# Altium schematic sheet Sheet1.SchDoc
size A4; SheetNumber: 1; SheetTotal: 1
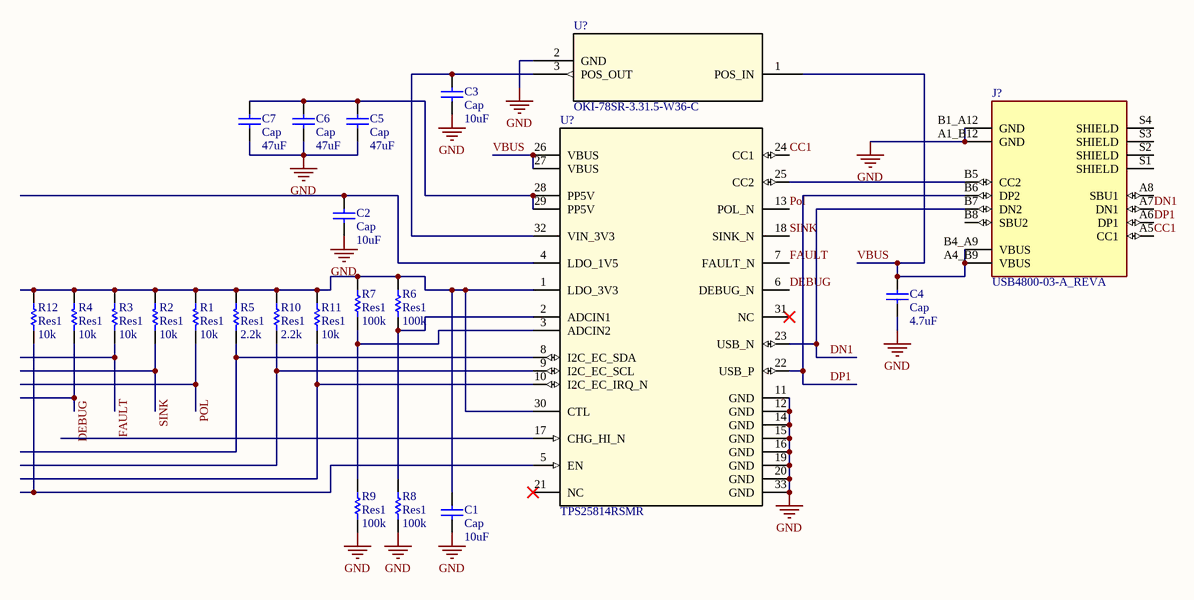
[diagram p0: Sheet1.SchDoc]

## Parts
(Parts that share a designator on the sheet are numbered #1, #2 ... from top to bottom, then left to right.)
C1  Cap  value 10uF  [RAD-0.3]
C2  Cap  value 10uF  [RAD-0.3]
C3  Cap  value 10uF  [RAD-0.3]
C4  Cap  value 4.7uF  [RAD-0.3]
C5  Cap  value 47uF  [RAD-0.3]
C6  Cap  value 47uF  [RAD-0.3]
C7  Cap  value 47uF  [RAD-0.3]
J?  USB4800-03-A_REVA  [GCT_USB4800-03-A_REVA]
R1  Res1  value 10k  [AXIAL-0.3]
R2  Res1  value 10k  [AXIAL-0.3]
R3  Res1  value 10k  [AXIAL-0.3]
R4  Res1  value 10k  [AXIAL-0.3]
R5  Res1  value 2.2k  [AXIAL-0.3]
R6  Res1  value 100k  [AXIAL-0.3]
R7  Res1  value 100k  [AXIAL-0.3]
R8  Res1  value 100k  [AXIAL-0.3]
R9  Res1  value 100k  [AXIAL-0.3]
R10  Res1  value 2.2k  [AXIAL-0.3]
R11  Res1  value 10k  [AXIAL-0.3]
R12  Res1  value 10k  [AXIAL-0.3]
U?#1  OKI-78SR-3.31.5-W36-C  [OKI-78SR_MUR]
U?#2  TPS25814RSMR  [RSM0032B-IPC_A]

## Nets
GND: C1.1 C2.1 C3.2 C4.2 C5.1 C6.1 C7.1 J?.A1_B12(GND) J?.B1_A12(GND) R8.1 R9.1 U?#1.2(GND) U?#2.11(GND) U?#2.12(GND) U?#2.14(GND) U?#2.15(GND) U?#2.16(GND) U?#2.19(GND) U?#2.20(GND) U?#2.33(GND)
CC1: J?.A5(CC1) U?#2.24(CC1)
DEBUG: R4.1 U?#2.6(DEBUG_N)
DN1: J?.A7(DN1) J?.B7(DN2) U?#2.23(USB_N)
DP1: J?.A6(DP1) J?.B6(DP2) U?#2.22(USB_P)
FAULT: R3.1 U?#2.7(FAULT_N)
Pol: R1.1 U?#2.13(POL_N)
SINK: R2.1 U?#2.18(SINK_N)
VBUS: C4.1 J?.A4_B9(VBUS) J?.B4_A9(VBUS) U?#1.1(POS_IN) U?#2.26(VBUS) U?#2.27(VBUS)
NetC1_2: C1.2 R1.2 R2.2 R3.2 R4.2 R5.2 R6.2 R7.2 R10.2 R11.2 R12.2 U?#2.1(LDO_3V3) U?#2.30(CTL)
NetC2_2: C2.2 U?#2.4(LDO_1V5)
NetC3_1: C3.1 U?#1.3(POS_OUT) U?#2.32(VIN_3V3)
NetC5_2: C5.2 C6.2 C7.2 U?#2.28(PP5V) U?#2.29(PP5V)
NetJ?_B5: J?.B5(CC2) U?#2.25(CC2)
NetR5_1: R5.1 U?#2.8(I2C_EC_SDA)
NetR6_1: R6.1 R8.2 U?#2.2(ADCIN1)
NetR7_1: R7.1 R9.2 U?#2.3(ADCIN2)
NetR10_1: R10.1 U?#2.9(I2C_EC_SCL)
NetR11_1: R11.1 U?#2.10(I2C_EC_IRQ_N)
NetR12_1: R12.1 U?#2.5(EN)

Not connected (* = marked no-connect by the designer): J? A8(SBU1) B8(SBU2) S1(SHIELD) S2(SHIELD) S3(SHIELD) S4(SHIELD); U?#2 17(CHG_HI_N) 21(NC)* 31(NC)*

## Library data of the parts
C1-C7 = Cap: Capacitor; Published: 8-Jun-2000; LatestRevisionDate: 17-Jul-2002; LatestRevisionNote: Re-released for DXP Platform.; PackageReference: RAD-0.3; Publisher: Altium Limited; PackageDescription: Radial Cap, Thru-Hole; 2 Leads; 0.3 in Pin Spacing
J? = USB4800-03-A_REVA: USB-C (USB TYPE-C) USB 2.0 Receptacle Connector 24 (16+8 Dummy) Position Surface Mount, Right Angle; Through Hole; MF: Global Connector Technology; SnapEDA_Link: https://www.snapeda.com/parts/USB4800-03-A/Global+Connector+Technology/view-part/?ref=snap; Package: None; MP: USB4800-03-A; Check_prices: https://www.snapeda.com/parts/USB4800-03-A/Global+Connector+Technology/view-part/?ref=eda; Purchase-URL: https://pricing.snapeda.com/search/part/USB4800-03-A/?ref=eda; Price: None; Value: *; Availability: In Stock
R1-R12 = Res1: Resistor; Published: 8-Jun-2000; LatestRevisionDate: 17-Jul-2002; LatestRevisionNote: Re-released for DXP Platform.; PackageReference: AXIAL-0.3; Publisher: Altium Limited; PackageDescription: Axial Device, Thru-Hole; 2 Leads; 0.3 in Pin Spacing
U?#1 = OKI-78SR-3.31.5-W36-C: No Description Available; Mfr_Name: Murata; RefDes: RefDes; Type: Type
U?#2 = TPS25814RSMR: No Description Available; Mfr_Name: Texas Instruments; TYPE: TYPE; RefDes: RefDes